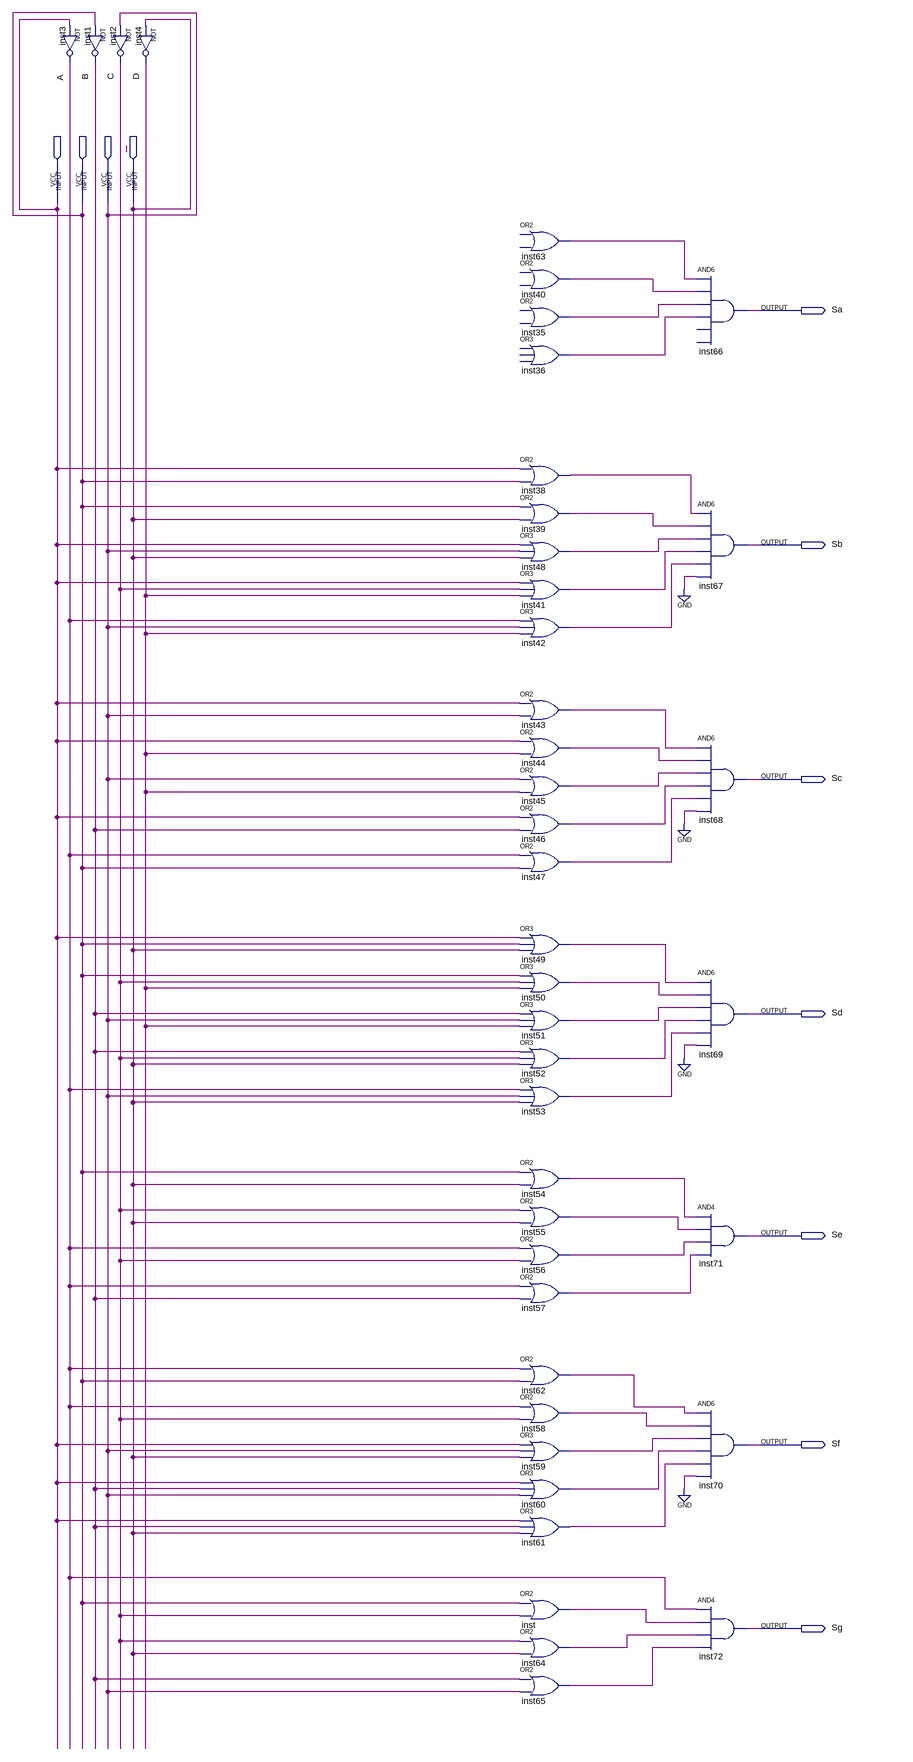
[diagram p0: schematic sheet]
// Quartus schematic Lab03_vs (copy 1) (copy 1).bdf as structural Verilog: 42 symbols, 11 pins
module \Lab03_vs_(copy_1)_(copy_1)  (
  input  A,
  input  B,
  input  C,
  input  D,
  output Sa,
  output Sb,
  output Sc,
  output Sd,
  output Se,
  output Sf,
  output Sg
);

  wire inst1_out, inst2_out, inst3_out, inst4_out, inst35_out, inst36_out, inst38_out, inst39_out,
       inst40_out, inst41_out, inst42_out, inst43_out, inst44_out, inst45_out, inst46_out, inst47_out,
       inst48_out, inst49_out, inst50_out, inst51_out, inst52_out, inst53_out, inst54_out, inst55_out,
       inst56_out, inst57_out, inst58_out, inst59_out, inst60_out, inst61_out, inst62_out, inst63_out,
       inst64_out, inst65_out, inst_out;

  not inst3 (inst3_out, A);
  not inst1 (inst1_out, B);
  not inst2 (inst2_out, C);
  not inst4 (inst4_out, D);
  // OR2 inst63 has open pins: IN1=open, IN2=open, OUT=inst63_out
  // OR2 inst40 has open pins: IN1=open, IN2=open, OUT=inst40_out
  // OR2 inst35 has open pins: IN1=open, IN2=open, OUT=inst35_out
  // OR3 inst36 has open pins: IN1=open, IN2=open, IN3=open, OUT=inst36_out
  or inst38 (inst38_out, A, B);
  or inst39 (inst39_out, B, D);
  or inst48 (inst48_out, A, C, D);
  or inst41 (inst41_out, A, inst2_out, inst4_out);
  or inst42 (inst42_out, inst3_out, C, inst4_out);
  or inst43 (inst43_out, A, C);
  or inst44 (inst44_out, A, inst4_out);
  or inst45 (inst45_out, C, inst4_out);
  or inst46 (inst46_out, A, inst1_out);
  or inst47 (inst47_out, inst3_out, B);
  or inst49 (inst49_out, A, B, D);
  or inst50 (inst50_out, B, inst2_out, inst4_out);
  or inst51 (inst51_out, inst1_out, C, inst4_out);
  or inst52 (inst52_out, inst1_out, inst2_out, D);
  or inst53 (inst53_out, inst3_out, C, D);
  or inst54 (inst54_out, B, D);
  or inst55 (inst55_out, inst2_out, D);
  or inst56 (inst56_out, inst3_out, inst2_out);
  or inst57 (inst57_out, inst3_out, inst1_out);
  or inst62 (inst62_out, inst3_out, B);
  or inst58 (inst58_out, inst3_out, inst2_out);
  or inst59 (inst59_out, A, C, D);
  or inst60 (inst60_out, A, inst1_out, C);
  or inst61 (inst61_out, A, inst1_out, D);
  or inst (inst_out, B, inst2_out);
  or inst64 (inst64_out, inst2_out, D);
  or inst65 (inst65_out, inst1_out, C);
  and inst66 (Sa, inst63_out, inst40_out, inst35_out, inst36_out);  // open: IN5, IN6
  and inst67 (Sb, inst38_out, inst39_out, inst48_out, inst41_out, inst42_out, 1'b0);
  and inst68 (Sc, inst43_out, inst44_out, inst45_out, inst46_out, inst47_out, 1'b0);
  and inst69 (Sd, inst49_out, inst50_out, inst51_out, inst52_out, inst53_out, 1'b0);
  and inst71 (Se, inst54_out, inst55_out, inst56_out, inst57_out);
  and inst70 (Sf, inst62_out, inst58_out, inst59_out, inst60_out, inst61_out, 1'b0);
  and inst72 (Sg, inst3_out, inst_out, inst64_out, inst65_out);
endmodule
